# Altium schematic sheet Mechanical.SchDoc
size A; SheetNumber: 17; SheetTotal: 18
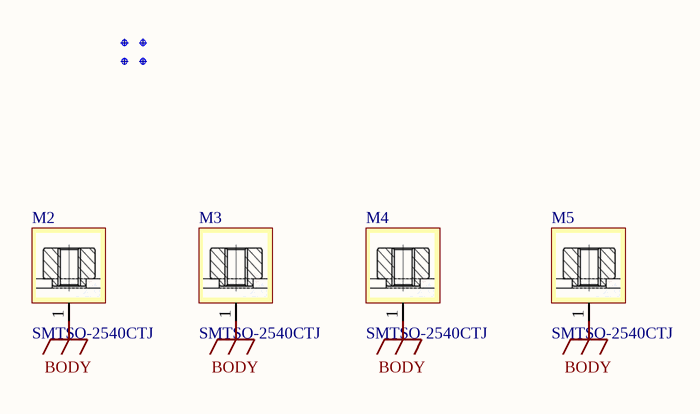
[diagram p0: Mechanical.SchDoc]

## Parts
Fid1  Fiducial mark  [Fiducial]  (value not drawn)  (no BOM)
Fid2  Fiducial mark  [Fiducial]  (value not drawn)  (no BOM)
Fid3  Fiducial mark  [Fiducial]  (value not drawn)  (no BOM)
Fid4  Fiducial mark  [Fiducial]  (value not drawn)  (no BOM)
M2  SMTSO-2540CTJ  [SMTSO-2540CTJ]
M3  SMTSO-2540CTJ  [SMTSO-2540CTJ]
M4  SMTSO-2540CTJ  [SMTSO-2540CTJ]
M5  SMTSO-2540CTJ  [SMTSO-2540CTJ]

## Nets
BODY: M2.1 M3.1 M4.1 M5.1

## Library data of the parts
Fid1-Fid4 = Fid-Mark: Manufacturer: N.A.; Value: N.A.; Pad Count: 1; Part Number: Fid-Mark; Manufacturer Part Number: N.A.; LatestRevisionDate: 2009-12-12; Published: 2009-12-12; Note: N.A.; Artikkelnr Noca: N.A.; Footprint Doc: Fiducial; Part number IPS: N.A.; ComponentLink1URL: N.A.; ComponentLink1Description: Datasheet; ComponentLink2URL: N.A.; ComponentLink2Description: Supplier link; HelpURL: N.A.; Supplier 1: N.A.; Supplier Part Number 1: N.A.; Supplier 2: N.A.; Supplier Part Number 2: N.A.; Component Class: Connectors; PartId: 100500073